# EAGLE design main (EAGLE 9.0.1)
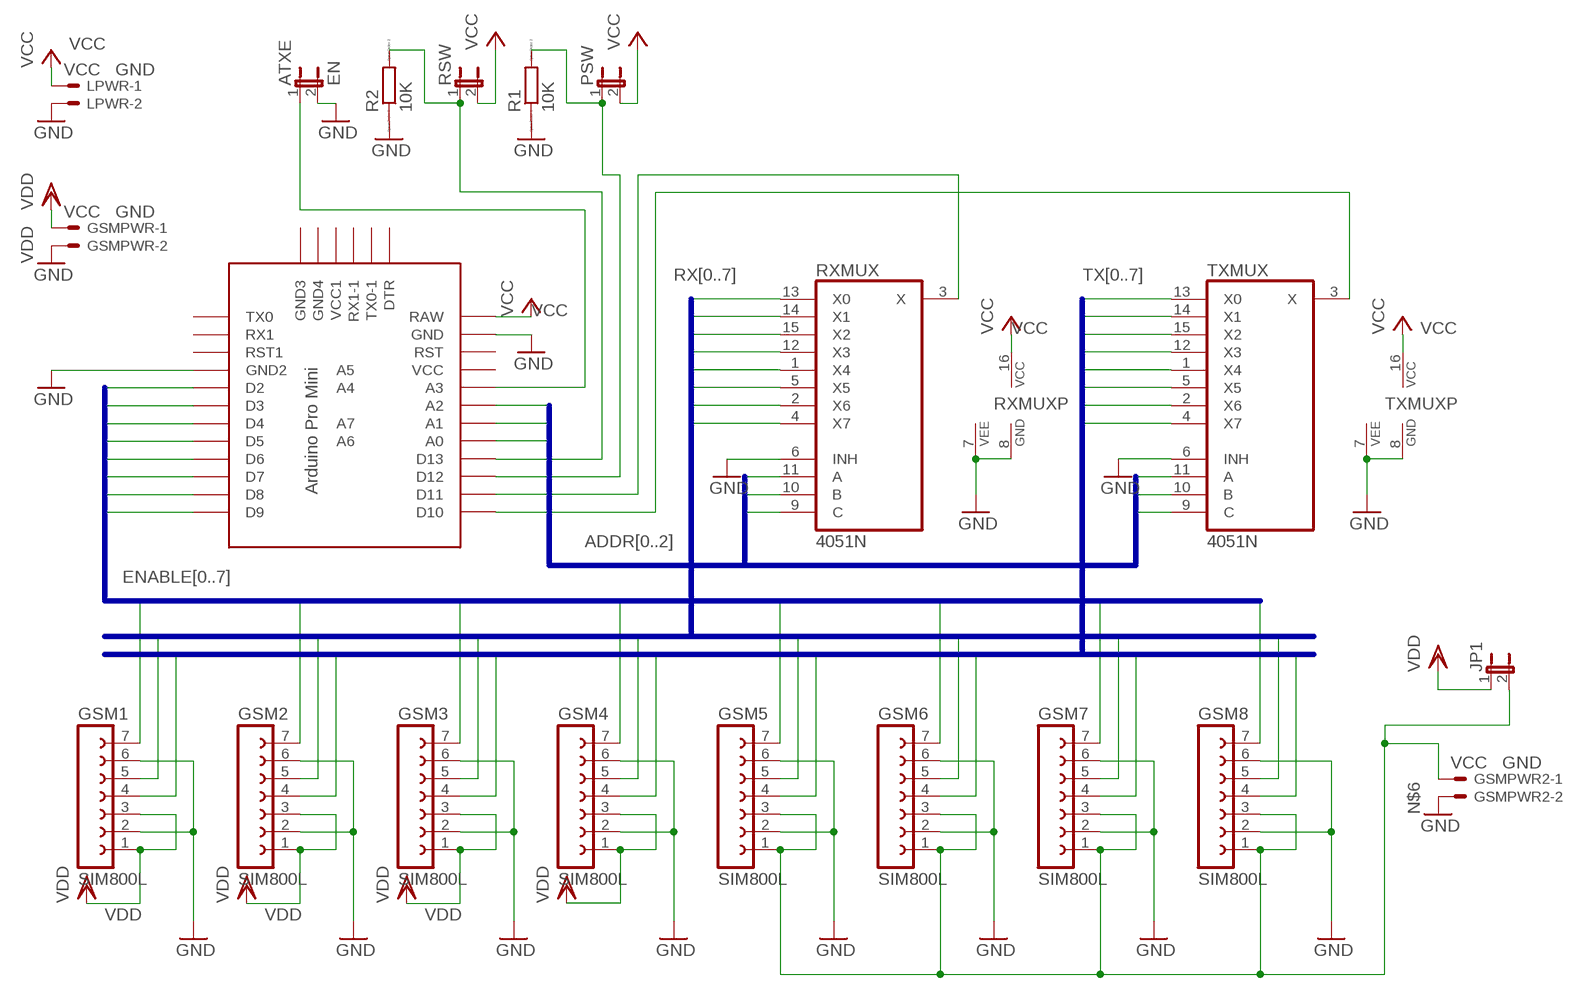
[diagram p0: schematic, sheet 1]

## Parts
ARDUINO  PRO-MINI  PRO-MINI-2  [PRO-MINI-2]
ATXE  EN  JP1E  [JP1]
GSM1  SIM800L  FE07-1  [FE07]
GSM2  SIM800L  FE07-1  [FE07]
GSM3  SIM800L  FE07-1  [FE07]
GSM4  SIM800L  FE07-1  [FE07]
GSM5  SIM800L  FE07-1  [FE07]
GSM6  SIM800L  FE07-1  [FE07]
GSM7  SIM800L  FE07-1  [FE07]
GSM8  SIM800L  FE07-1  [FE07]
GSMPWR  VCC GND  22-23-2021  [22-23-2021]
GSMPWR2  VCC GND  22-23-2021  [22-23-2021]
JP1  JP1E  [JP1]
LPWR  VCC GND  22-23-2021  [22-23-2021]
PSW  JP1E  [JP1]
R1  10K  R0204/7  [0204/7]
R2  10K  R0204/7  [0204/7]
RSW  JP1E  [JP1]
RXMUX  4051N  [DIL16]
TXMUX  4051N  [DIL16]

## Nets
ADDR0: ARDUINO.A2 RXMUX.11(A) TXMUX.11(A)
ADDR1: ARDUINO.A1 RXMUX.10(B) TXMUX.10(B)
ADDR2: ARDUINO.A0 RXMUX.9(C) TXMUX.9(C)
ENABLE0: ARDUINO.D2 GSM1.7
ENABLE1: ARDUINO.D3 GSM2.7
ENABLE2: ARDUINO.D4 GSM3.7
ENABLE3: ARDUINO.D5 GSM4.7
ENABLE4: ARDUINO.D6 GSM5.7
ENABLE5: ARDUINO.D7 GSM6.7
ENABLE6: ARDUINO.D8 GSM7.7
ENABLE7: ARDUINO.D9 GSM8.7
GND: ARDUINO.GND ARDUINO.GND1(GND2) ATXE.2 GSM1.2 GSM1.6 GSM2.2 GSM2.6 GSM3.2 GSM3.6 GSM4.2 GSM4.6 GSM5.2 GSM5.6 GSM6.2 GSM6.6 GSM7.2 GSM7.6 GSM8.2 GSM8.6 GSMPWR2.2 GSMPWR.2 LPWR.2 R1.1 R2.1 RXMUX.6(INH) RXMUX.7(VEE) RXMUX.8(GND) TXMUX.6(INH) TXMUX.7(VEE) TXMUX.8(GND)
N$1: ARDUINO.D11 RXMUX.3(X)
N$2: ARDUINO.D10 TXMUX.3(X)
N$5: ARDUINO.D13 R2.2 RSW.1
N$6: GSM5.1 GSM5.3 GSM6.1 GSM6.3 GSM7.1 GSM7.3 GSM8.1 GSM8.3 GSMPWR2.1 JP1.2
N$7: ARDUINO.A3 ATXE.1
N$9: ARDUINO.D12 PSW.1 R1.2
RX0: GSM1.5 RXMUX.13(X0)
RX1: GSM2.5 RXMUX.14(X1)
RX2: GSM3.5 RXMUX.15(X2)
RX3: GSM4.5 RXMUX.12(X3)
RX4: GSM5.5 RXMUX.1(X4)
RX5: GSM6.5 RXMUX.5(X5)
RX6: GSM7.5 RXMUX.2(X6)
RX7: GSM8.5 RXMUX.4(X7)
TX0: GSM1.4 TXMUX.13(X0)
TX1: GSM2.4 TXMUX.14(X1)
TX2: GSM3.4 TXMUX.15(X2)
TX3: GSM4.4 TXMUX.12(X3)
TX4: GSM5.4 TXMUX.1(X4)
TX5: GSM6.4 TXMUX.5(X5)
TX6: GSM7.4 TXMUX.2(X6)
TX7: GSM8.4 TXMUX.4(X7)
VCC: ARDUINO.RAW LPWR.1 PSW.2 RSW.2 RXMUX.16(VCC) TXMUX.16(VCC)
VDD: GSM1.1 GSM1.3 GSM2.1 GSM2.3 GSM3.1 GSM3.3 GSM4.1 GSM4.3 GSMPWR.1 JP1.1
Unconnected: ARDUINO.A4 ARDUINO.A5 ARDUINO.A6 ARDUINO.A7 ARDUINO.DTR ARDUINO.GND2(GND3) ARDUINO.GND3(GND4) ARDUINO.RST ARDUINO.RST1 ARDUINO.RX1 ARDUINO.RX1-1 ARDUINO.TX0 ARDUINO.TX0-1 ARDUINO.VCC ARDUINO.VCC1

## Buses
ADDR[0..2]
ENABLE[0..7]
TX[0..7]
RX[0..7]

## Library data of the parts
ARDUINO = Arduino-clone:PRO-MINI-2: Arduino Pro Mini Layout 2 Sparkfun.com
ATXE JP1 PSW RSW = jumper:JP1E: JUMPER
GSM1-GSM8 = con-lsta:FE07-1: FEMALE HEADER; OC_FARNELL: unknown; OC_NEWARK: unknown
GSMPWR GSMPWR2 LPWR = con-molex:22-23-2021: .100" (2.54mm) Center Header - 2 Pin; MF: MOLEX; MPN: 22-23-2021; OC_FARNELL: 1462926; OC_NEWARK: 25C3832; SPICEPREFIX: X
R1 R2 = eagle-ltspice:R: RESISTOR, European symbol; SPICEMODEL: NONE; SPICEPREFIX: R
RXMUX TXMUX = 40xx:4051: 8-channel ANALOG MULTIPLEXER

## Board
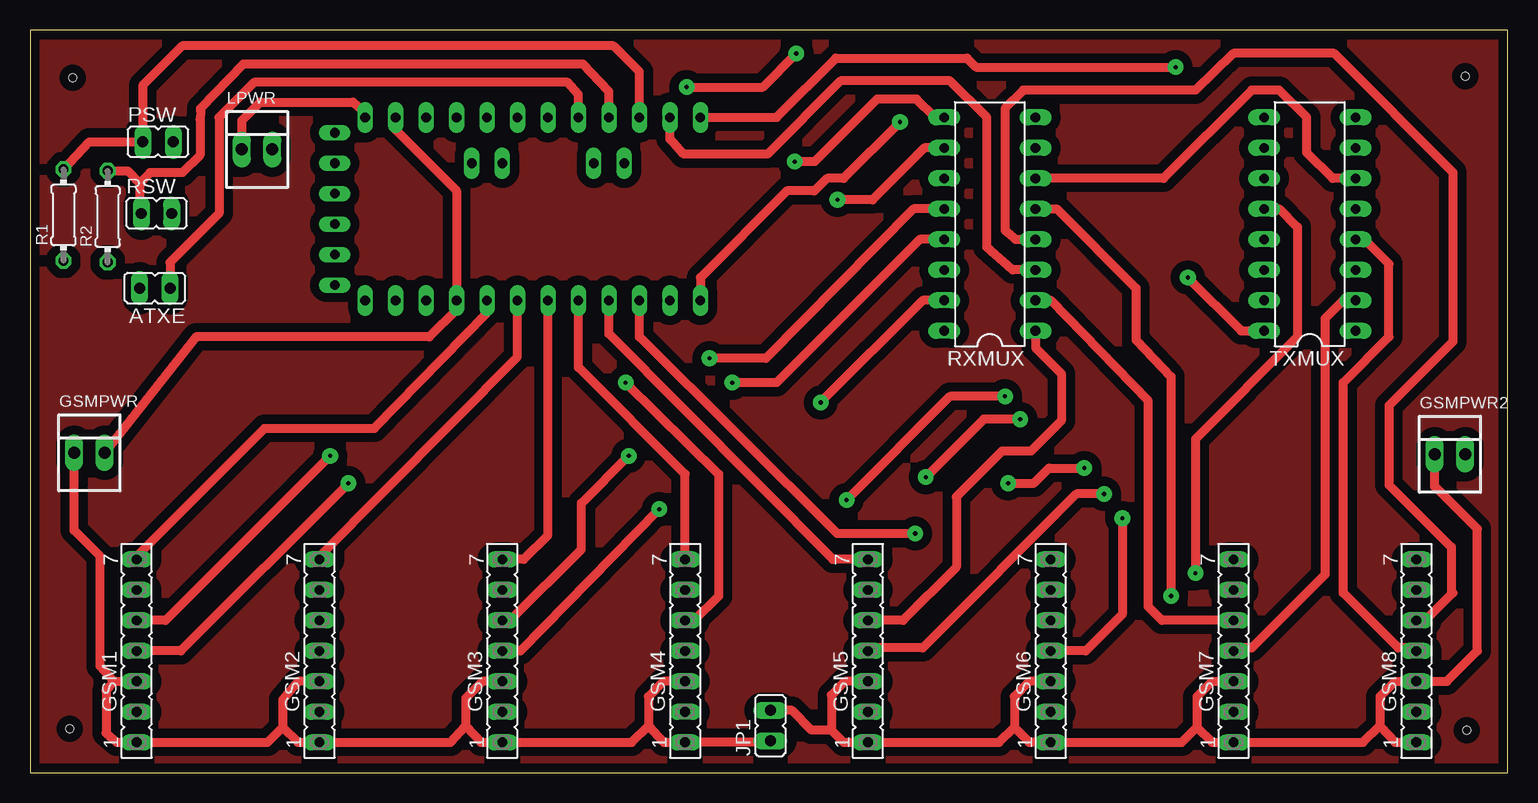
[diagram p1: board, top side]
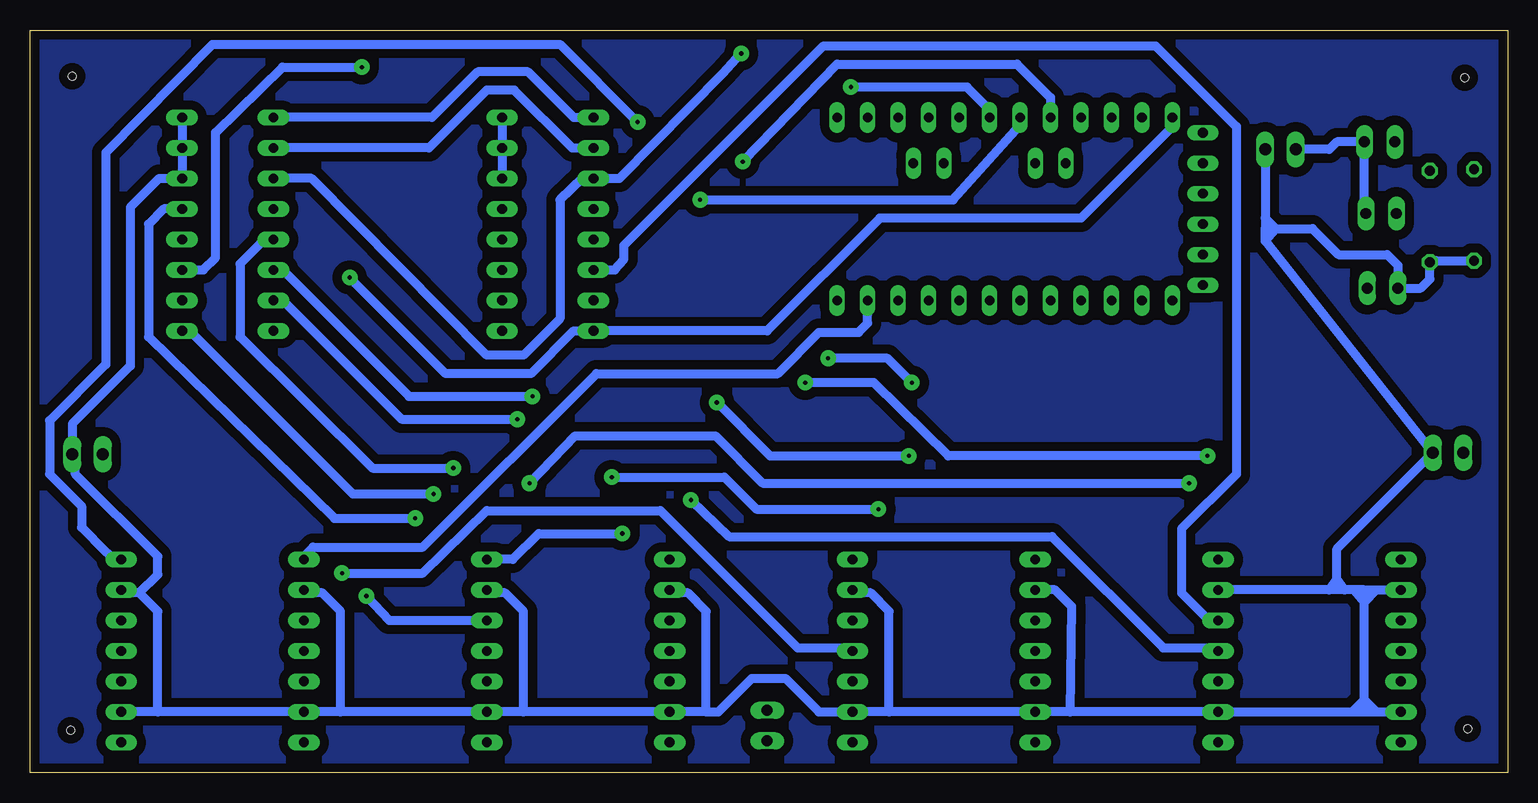
[diagram p2: board, bottom side, seen from below]

Size 123.17 x 61.9 mm. Coordinates in mm from the lower left corner, seen from the top.
Outline: 0,0 123.17,0 123.17,61.9 0,61.9 0,0
Copper layers (1*16): Top 0.035mm / dielectric 1.5mm / Bottom 0.035mm
Design rules "default *": minimum track width 30mil, minimum drill 0.35mm, track to track 30mil, track to pad 30mil, pad to pad 25mil, via to via 30mil, smd to smd 30mil, copper to edge 30mil, drill to drill 40mil, minimum pad ring 10mil, minimum via ring 8mil, stop-mask expansion 4mil, vias tented up to drill 0mil, thermal gap 10mil
Holes 0.65 mm at 3.56,57.91 3.3,3.68 119.76,3.56 119.63,58.04

### Footprints (pad centres in the part's own frame; a part is rotated, then mirrored left to right if it is on the bottom)
PRO-MINI-2 = drill 0.8 long: A0 6.35,2.54; A1 6.35,0; A2 6.35,-2.54; A3 6.35,-5.08; A4 2.54,1.27; A5 2.54,3.81; A6 2.54,-8.89; A7 2.54,-6.35; D2 -8.89,2.54; D3 -8.89,0; D4 -8.89,-2.54; D5 -8.89,-5.08; D6 -8.89,-7.62; D7 -8.89,-10.16; D8 -8.89,-12.7; D9 -8.89,-15.24; D10 6.35,-15.24; D11 6.35,-12.7; D12 6.35,-10.16; D13 6.35,-7.62; DTR 5.08,15.24; GND 6.35,10.16; GND1 -8.89,5.08; GND2 -7.62,15.24; GND3 -5.08,15.24; RAW 6.35,12.7; RST 6.35,7.62; RST1 -8.89,7.62; RX1 -8.89,10.16; RX1-1 0,15.24; TX0 -8.89,12.7; TX0-1 2.54,15.24; VCC 6.35,5.08; VCC1 -2.54,15.24
JP1 = drill 0.914 long: 1 0,-1.27; 2 0,1.27
FE07 = drill 0.813 long: 1 -7.62,0; 2 -5.08,0; 3 -2.54,0; 4 0,0; 5 2.54,0; 6 5.08,0; 7 7.62,0
22-23-2021 = drill 1 long: 1 -1.27,0; 2 1.27,0
0204/7 = drill 0.813 octagon: 1 -3.81,0; 2 3.81,0
DIL16 = drill 0.813 long: 1 -8.89,-3.81; 2 -6.35,-3.81; 3 -3.81,-3.81; 4 -1.27,-3.81; 5 1.27,-3.81; 6 3.81,-3.81; 7 6.35,-3.81; 8 8.89,-3.81; 9 8.89,3.81; 10 6.35,3.81; 11 3.81,3.81; 12 1.27,3.81; 13 -1.27,3.81; 14 -3.81,3.81; 15 -6.35,3.81; 16 -8.89,3.81

### Placement (x,y rotation side)
ARDUINO  40.64,48.26 90 top
ATXE  10.41,40.39 90 top
GSM1  8.89,10.16 90 top
GSM2  24.13,10.16 90 top
GSM3  39.37,10.16 90 top
GSM4  54.61,10.16 90 top
GSM5  69.85,10.16 90 top
GSM6  85.09,10.16 90 top
GSM7  100.33,10.16 90 top
GSM8  115.57,10.16 90 top
GSMPWR  4.95,26.67 0 top
GSMPWR2  118.36,26.54 0 top
JP1  61.72,3.94 0 top
LPWR  18.92,51.94 0 top
PSW  10.67,52.58 270 top
R1  2.79,46.48 90 top
R2  6.48,46.36 90 top
RSW  10.54,46.61 270 top
RXMUX  80.01,45.72 90 top
TXMUX  106.68,45.72 90 top

### Tracks (layer width: path | path; a pad name or v marks a point on that pad's centre or on a via)
ADDR0  (via drill 0.35 pad 1.3)
  Top 0.762: v54.74,57.15 61.09,57.15 v63.88,59.94
  Bottom 0.762: v63.88,59.94 65.41,58.29 74.04,49.53 RXMUX.11 77.09,49.53 78.99,47.75 78.99,37.85 82.04,34.8 85.09,34.8 99.7,49.53 TXMUX.11 | ARDUINO.A2 43.18,55.27 45.06,57.15 v54.74,57.15
ADDR1  (via drill 0.35 pad 1.3)
  Top 0.762: v67.31,47.75 70.23,47.75 74.55,52.07 RXMUX.10
  Bottom 0.762: ARDUINO.A1 40.64,53.98 46.23,47.75 v67.31,47.75 | TXMUX.10 89.92,52.07 85.09,56.9 82.8,56.9 77.98,52.07 RXMUX.10
ADDR2  (via drill 0.35 pad 1.3)
  Top 0.762: v63.75,50.93 65.41,50.93 70.61,56.13 73.91,56.13 75.44,54.61 RXMUX.9
  Bottom 0.762: ARDUINO.A0 38.1,56.26 40.89,59.05 55.88,59.05 v63.75,50.93 | TXMUX.9 89.66,54.61 85.85,58.42 81.66,58.42 77.85,54.61 RXMUX.9
ENABLE0
  Top 0.762: ARDUINO.D2 38.1,38.35 28.7,28.7 19.56,28.7 8.89,18.03 GSM1.7
ENABLE1
  Top 0.762: ARDUINO.D3 40.64,34.67 24.13,18.03 GSM2.7
ENABLE2
  Top 0.762: ARDUINO.D4 43.18,19.81 41.15,17.78 GSM3.7
ENABLE3
  Top 0.762: ARDUINO.D5 45.72,33.78 54.61,24.89 GSM4.7
ENABLE4
  Top 0.762: ARDUINO.D6 48.26,36.58 66.93,17.78 GSM5.7
ENABLE5  (via drill 0.35 pad 1.3)
  Top 0.762: ARDUINO.D7 50.8,36.32 67.31,19.94 v73.79,19.94
  Bottom 0.762: v73.79,19.94 80.77,19.94 82.93,17.78 GSM6.7
ENABLE6
  Bottom 0.762: 53.34,38.23 ARDUINO.D8 53.34,37.47 54.1,36.7 57.4,36.7 60.83,33.27 75.95,33.27 90.42,18.8 99.57,18.8 100.33,18.03 GSM7.7
ENABLE7  (via drill 0.35 pad 1.3)
  Top 0.762: v72.52,54.23 67.83,49.55 66.44,49.55 65.39,48.5 63.1,48.5 55.88,41.28 ARDUINO.D9
  Bottom 0.762: v72.52,54.23 78.99,60.71 107.95,60.71 116.84,51.69 116.84,34.03 121.53,29.34 121.53,24.89 118.87,22.23 118.87,20.45 116.84,18.41 116.08,17.78 GSM8.7
GND
  Top 0.762: RXMUX.6 94.49,49.53 101.85,56.9 104.14,56.9 106.43,54.61 106.43,51.69 108.58,49.53 TXMUX.6 | ARDUINO.GND 30.35,54.61 30.35,53.72 35.56,48.51 ARDUINO.GND1 35.56,38.61 33.27,36.32 13.84,36.32 GSMPWR.2
  Bottom 0.762: 12.83,5.08 GSM2.2 36.45,5.08 | 12.83,5.08 11.94,5.08 | 11.94,5.08 10.92,5.08 | 10.92,5.08 GSM1.2 | 36.45,5.08 GSM3.2 51.56,5.08 | 51.56,5.08 GSM4.2 57.4,5.08 60.2,7.87 62.99,7.87 65.79,5.08 66.8,5.08 | 66.8,5.08 GSM5.2 82.04,5.08 | 82.04,5.08 GSM6.2 97.28,5.08 | 11.94,15.24 10.92,15.24 | 10.92,15.24 GSM1.6 | 11.94,5.08 11.94,6.1 | 11.94,6.1 11.94,14.22 | 11.94,14.22 11.94,15.24 | 13.59,15.24 GSM2.6 | 11.94,15.24 12.83,15.24 | 12.83,15.24 13.59,15.24 | GSM3.6 37.72,15.24 36.32,13.84 36.45,5.08 | 51.56,5.08 51.56,13.46 53.09,14.99 54.61,14.99 GSM4.6 | 66.8,5.08 66.8,13.46 68.33,14.99 69.85,14.99 GSM5.6 | 82.04,5.08 82.04,13.46 83.57,14.99 85.09,14.99 GSM6.6 | 97.28,5.08 GSM7.2 112.52,5.08 | 97.28,5.08 97.28,13.46 98.81,14.99 100.33,14.99 GSM7.6 | 112.52,5.08 GSM8.2 | 114.05,14.99 115.57,14.99 GSM8.6 | 114.05,14.99 112.52,13.46 112.52,5.08 | 14.22,16.13 14.22,18.67 GSMPWR.2 20.19,44.32 | 114.05,14.99 112.52,16.51 112.52,18.03 119.38,24.89 119.38,26.29 GSMPWR2.2 119.63,29.08 114.81,33.91 114.81,36.31 114.82,36.93 114.81,36.94 114.81,47.12 112.39,49.53 TXMUX.6 TXMUX.7 TXMUX.8 | RXMUX.8 RXMUX.7 RXMUX.6 | 14.22,16.13 14.86,15.24 | 14.22,16.13 13.59,15.24 | 12.83,15.24 11.94,14.22 | 11.94,14.22 10.92,15.24 | 11.94,6.1 10.92,5.08 | 11.94,6.1 12.83,5.21 12.83,5.08 | LPWR.2 20.19,46.23 | 20.19,46.23 20.19,45.34 | 20.19,44.32 20.19,45.34 | 20.19,45.34 19.3,45.34 | 19.3,45.34 16.26,45.34 14.1,43.18 10.03,43.18 9.14,42.29 ATXE.2 7.24,40.39 6.48,41.15 R2.1 5.97,42.67 R1.1 | 20.19,44.32 19.3,45.34 | 20.19,46.23 19.3,45.34
N$1
  Top 0.762: ARDUINO.D11 53.34,52.83 54.48,51.56 61.47,51.56 67.56,57.66 76.71,57.66 79.76,54.61 79.76,43.82 81.92,41.91 RXMUX.3
N$2  (via drill 0.35 pad 1.3)
  Top 0.762: ARDUINO.D10 62.23,54.61 67.18,59.56 78.11,59.56 78.87,58.8 v95.5,58.8
  Bottom 0.762: v95.5,58.8 102.11,58.8 107.7,53.34 107.7,42.93 108.71,41.91 TXMUX.3
N$3
  pour Top: 0.63,61.6 123.19,61.6 123.19,0 0.63,0 0,0 0,61.6
  pour Bottom: 0.63,61.6 123.19,61.6 123.19,0 0.63,0 0,0 0,61.6
N$5
  Top 0.762: ARDUINO.D13 48.26,56.77 46.1,59.05 17.78,59.05 14.22,55.37 14.22,55.15 14.17,54.44 14.17,51.48 12.71,50.01 10.01,50.01 9.14,49.15 | 9.14,49.15 9.14,46.74 RSW.1 | R2.2 8.13,50.17 9.14,49.15
N$6
  Top 0.762: 112.52,3.94 113.79,2.54 GSM8.1 115.7,2.54 | 112.52,3.94 112.52,6.35 113.79,7.62 GSM8.3 118.11,7.62 120.65,10.16 120.65,20.32 117.09,23.88 GSMPWR2.1 | 112.52,3.94 111.12,2.54 GSM7.1 98.55,2.54 97.28,3.81 | 97.28,3.81 97.28,6.35 98.55,7.62 GSM7.3 | 97.28,3.81 96.01,2.54 GSM6.1 83.31,2.54 82.04,3.81 | 82.04,3.81 82.04,6.35 83.31,7.62 GSM6.3 | 82.04,3.81 80.77,2.54 GSM5.1 67.82,2.54 66.8,3.56 | 69.47,7.56 69.52,7.62 GSM5.3 67.94,7.62 66.8,6.48 66.8,3.56 | 66.8,3.56 65.15,3.56 63.5,5.21 JP1.2
N$7
  Top 0.762: ARDUINO.A3 45.72,56.52 44.83,57.53 18.67,57.53 15.76,54.61 15.76,46.62 11.68,42.55 ATXE.1
N$9
  Top 0.762: ARDUINO.D12 50.8,58.42 48.64,60.58 12.7,60.58 9.4,57.28 PSW.1 4.95,52.58 R1.2
RX0  (via drill 0.35 pad 1.3)
  Top 0.762: GSM1.5 11.3,12.7 v25.02,26.42 | v58.55,32.51 62.23,32.51 74.17,44.45 RXMUX.13
  Bottom 0.762: v25.02,26.42 46.61,26.42 52.83,32.51 v58.55,32.51
RX1
  Bottom 0.762: GSM2.5 24.89,12.7 27.18,14.99 27.18,20.32 22.61,24.89 22.61,53.85 29.34,60.58 31.62,60.58 57.02,60.58 73.66,43.94 73.66,42.8 74.42,41.91 RXMUX.14
RX2  (via drill 0.35 pad 1.3)
  Top 0.762: v65.91,30.86 74.42,39.37 RXMUX.15 | GSM3.5 40.04,12.7 45.97,18.63 45.97,22.48 v49.91,26.42
  Bottom 0.762: v49.91,26.42 61.47,26.42 v65.91,30.86
RX3  (via drill 0.35 pad 1.3)
  Top 0.762: GSM4.5 55.37,12.7 57.4,14.73 57.4,24.89 v49.66,32.51 | v56.64,34.54 61.34,34.54 73.66,46.99 RXMUX.12
  Bottom 0.762: v49.66,32.51 51.69,34.54 v56.64,34.54
RX4
  Top 0.762: 70.61,12.7 GSM5.5 72.77,12.7 77.22,17.14 77.22,22.99 81.03,26.8 83.44,26.8 85.98,29.34 85.98,33.27 83.82,35.43 RXMUX.1
RX5  (via drill 0.35 pad 1.3)
  Top 0.762: RXMUX.5 85.6,46.99 92.2,40.39 92.2,36.07 95.12,33.02 v95.12,14.73
  Bottom 0.762: GSM6.5 93.22,12.7 v95.12,14.73
RX6
  Top 0.762: RXMUX.2 85.09,39.37 93.22,30.99 93.22,13.84 94.36,12.7 GSM7.5
RX7
  Top 0.762: RXMUX.4 82.17,44.45 81.28,45.21 81.28,55.37 82.8,56.9 97.15,56.9 100.33,59.94 108.71,59.94 118.62,50.04 118.62,35.94 113.28,30.61 113.28,24 118.49,18.8 118.49,15.11 118.62,14.99 116.33,12.7 GSM8.5
TX0  (via drill 0.35 pad 1.3)
  Top 0.762: GSM1.4 12.57,10.16 v26.54,24.13 | v81.53,24.13 83.69,24.13 84.83,25.27 84.96,25.4 v87.88,25.4
  Bottom 0.762: v26.54,24.13 62.1,24.13 66.04,28.07 77.72,28.07 v81.53,24.13 | v87.88,25.4 94.61,25.4 105.66,36.32 105.66,42.42 103.38,44.7 TXMUX.13
TX1  (via drill 0.35 pad 1.3)
  Top 0.762: v68.07,22.73 76.71,31.37 v81.28,31.37
  Bottom 0.762: v68.07,22.73 64.9,19.68 37.97,19.68 28.7,10.41 24.13,10.41 GSM2.4 | v81.28,31.37 91.57,31.37 102.11,41.91 TXMUX.14
TX2  (via drill 0.35 pad 1.3)
  Top 0.762: GSM3.4 40.89,10.16 v52.45,21.97 | v82.55,29.46 79.5,29.46 v74.68,24.64
  Bottom 0.762: v52.45,21.97 62.61,21.97 65.28,24.64 v74.68,24.64 | v82.55,29.46 92.2,29.46 102.11,39.37 TXMUX.15
TX3  (via drill 0.35 pad 1.3)
  Top 0.762: v97.15,16.64 97.15,27.81 105.66,36.32 105.66,45.47 104.14,46.99 TXMUX.12
  Bottom 0.762: v97.15,16.64 90.42,16.64 85.09,21.84 70.61,21.84 59.18,10.41 54.61,10.41 GSM4.4
TX4  (via drill 0.35 pad 1.3)
  Top 0.762: v89.54,23.24 87.25,23.24 74.42,10.41 69.85,10.41 GSM5.4
  Bottom 0.762: v89.54,23.24 96.27,23.24 109.86,36.83 TXMUX.1
TX5  (via drill 0.35 pad 1.3)
  Top 0.762: GSM6.4 88.01,10.16 91.06,13.21 v91.06,21.21
  Bottom 0.762: v91.06,21.21 97.79,21.21 113.28,36.32 113.28,45.72 112.01,46.99 TXMUX.5
TX6
  Top 0.762: TXMUX.2 109.47,39.37 107.95,37.85 107.95,16.51 101.85,10.41 100.33,10.41 GSM7.4
TX7
  Top 0.762: GSM8.4 115.57,10.41 114.05,10.41 109.47,14.99 109.47,32.51 113.28,36.32 113.28,42.42 111,44.7 TXMUX.4
VCC  (via drill 0.35 pad 1.3)
  Top 0.762: v96.52,41.28 100.96,36.83 TXMUX.16 | LPWR.1 17.65,54.36 19.18,55.88 26.92,55.88 27.94,54.99 ARDUINO.RAW 27.94,53.85 28.07,53.98
  Bottom 0.762: v96.52,41.28 88.52,33.27 85.09,33.27 84.47,33.27 84.46,33.27 81.41,33.27 77.86,36.83 RXMUX.16 61.72,36.83 52.32,46.23 35.56,46.23 27.94,53.85 ARDUINO.RAW | RSW.2 11.94,46.74 PSW.2 14.22,52.58 14.86,51.94 LPWR.1
VDD
  Top 0.762: 6.98,7.62 6.35,6.86 6.35,3.3 7.24,2.54 GSM1.1 19.81,2.54 21.08,3.81 | GSMPWR.1 3.68,20.19 5.84,18.03 5.84,8.89 6.98,7.62 | 21.08,3.81 22.35,2.54 GSM2.1 35.05,2.54 36.32,3.94 | 21.08,3.81 21.08,6.1 22.35,7.62 GSM2.3 24.26,7.62 | 36.32,3.94 37.59,2.54 GSM3.1 50.17,2.54 51.56,3.94 | 36.32,3.94 36.32,6.22 37.72,7.62 GSM3.3 | 51.56,3.94 52.83,2.54 GSM4.1 61.59,2.54 JP1.1 | 51.56,3.94 51.56,6.35 52.83,7.62 GSM4.3 | 6.98,7.62 GSM1.3